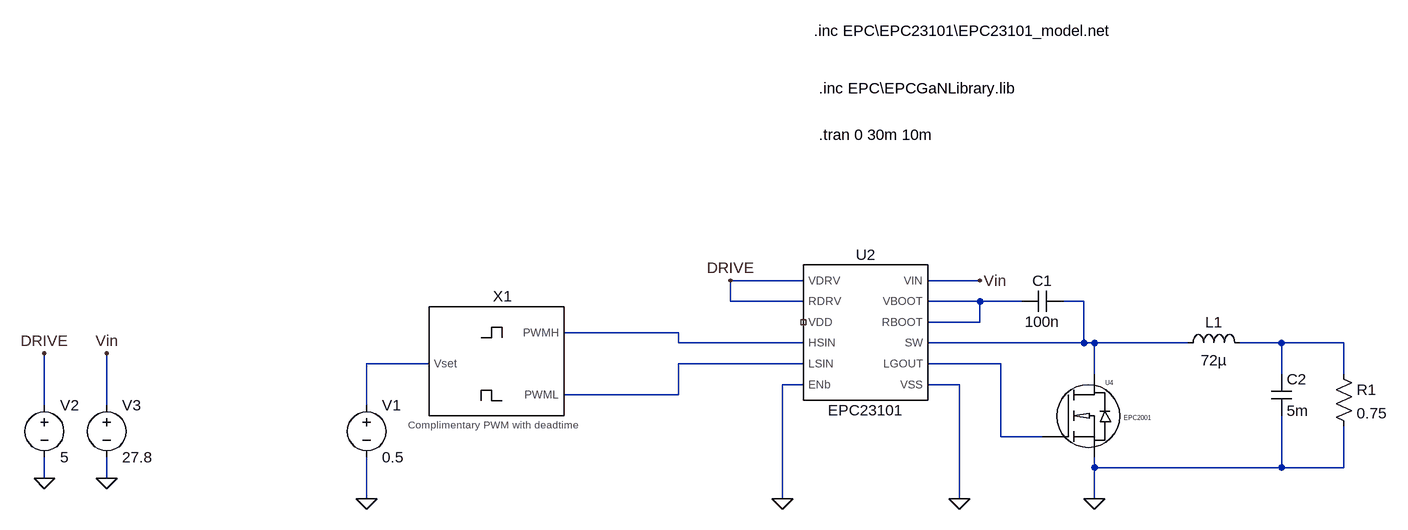
[diagram p0: schematic GaN.asc]
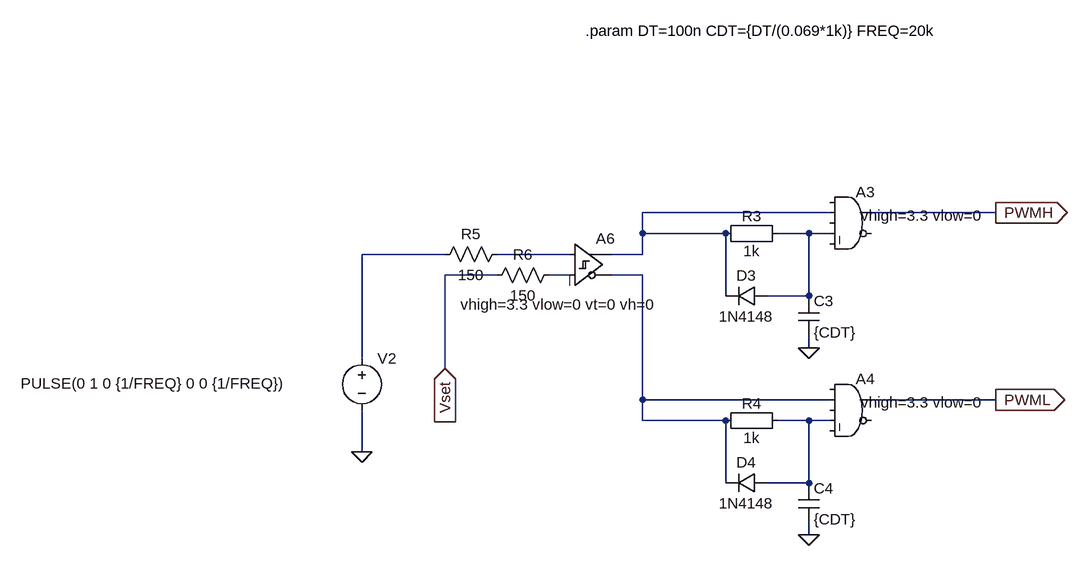
[diagram p1: sub-circuit pwmgen.asc]
GaN.asc, the LTspice schematic file:
Version 4.1
SHEET 1 1408 776
WIRE -224 -368 -336 -368
WIRE 48 -368 -32 -368
WIRE -336 -336 -336 -368
WIRE -224 -336 -336 -336
WIRE 48 -336 -32 -336
WIRE 112 -336 48 -336
WIRE 208 -336 176 -336
WIRE 48 -304 48 -336
WIRE 48 -304 -32 -304
WIRE -416 -288 -592 -288
WIRE -416 -272 -416 -288
WIRE -224 -272 -416 -272
WIRE 208 -272 208 -336
WIRE 208 -272 -32 -272
WIRE 224 -272 208 -272
WIRE 368 -272 224 -272
WIRE 512 -272 448 -272
WIRE 608 -272 512 -272
WIRE -800 -240 -896 -240
WIRE -224 -240 -416 -240
WIRE 80 -240 -32 -240
WIRE 224 -224 224 -272
WIRE 512 -224 512 -272
WIRE 608 -224 608 -272
WIRE -224 -208 -256 -208
WIRE 16 -208 -32 -208
WIRE -416 -192 -416 -240
WIRE -416 -192 -592 -192
WIRE -1392 -176 -1392 -256
WIRE -1296 -176 -1296 -256
WIRE -896 -176 -896 -240
WIRE 80 -128 80 -240
WIRE 144 -128 80 -128
WIRE 224 -80 224 -96
WIRE 512 -80 512 -160
WIRE 512 -80 224 -80
WIRE 608 -80 608 -144
WIRE 608 -80 512 -80
WIRE -1392 -64 -1392 -96
WIRE -1296 -64 -1296 -96
WIRE -896 -32 -896 -96
WIRE -256 -32 -256 -208
WIRE 16 -32 16 -208
WIRE 224 -32 224 -80
FLAG 48 -368 Vin
FLAG 16 -32 0
FLAG 224 -32 0
FLAG -256 -32 0
FLAG -336 -368 DRIVE
FLAG -896 -32 0
FLAG -1296 -64 0
FLAG -1392 -64 0
FLAG -1392 -256 DRIVE
FLAG -1296 -256 Vin
SYMBOL EPC\\EPC23101\\EPC23101_model -128 -288 R0
SYMATTR InstName U2
SYMBOL EPC\\EPCGaN 144 -128 R0
SYMATTR InstName U4
SYMATTR Value EPC2001
SYMBOL cap 176 -352 R90
WINDOW 0 0 32 VBottom 2
WINDOW 3 32 32 VTop 2
SYMATTR InstName C1
SYMATTR Value 100n
SYMBOL PWMGen\\PWMGen -688 -240 R0
SYMATTR InstName X1
SYMBOL voltage -896 -192 R0
WINDOW 123 0 0 Left 0
WINDOW 39 0 0 Left 0
SYMATTR InstName V1
SYMATTR Value 0.5
SYMBOL voltage -1392 -192 R0
WINDOW 123 0 0 Left 0
WINDOW 39 0 0 Left 0
SYMATTR InstName V2
SYMATTR Value 5
SYMBOL voltage -1296 -192 R0
WINDOW 123 0 0 Left 0
WINDOW 39 0 0 Left 0
SYMATTR InstName V3
SYMATTR Value 27.8
SYMBOL ind 352 -256 R270
WINDOW 0 32 56 VTop 2
WINDOW 3 5 56 VBottom 2
SYMATTR InstName L1
SYMATTR Value 72µ
SYMBOL cap 496 -224 R0
SYMATTR InstName C2
SYMATTR Value 5m
SYMBOL res 592 -240 R0
SYMATTR InstName R1
SYMATTR Value 0.75
TEXT -208 -752 Left 2 !.inc EPC\\EPC23101\\EPC23101_model.net
TEXT -200 -664 Left 2 !.inc EPC\\EPCGaNLibrary.lib
TEXT -200 -592 Left 2 !.tran 0 30m 10m

pwmgen.asc, the sub-circuit schematic file:
Version 4.1
SHEET 1 880 680
WIRE 384 0 96 0
WIRE 640 0 448 0
WIRE 96 32 96 0
WIRE 224 32 96 32
WIRE 352 32 304 32
WIRE 384 32 352 32
WIRE -208 64 -336 64
WIRE -16 64 -128 64
WIRE 96 64 96 32
WIRE 96 64 48 64
WIRE -128 96 -208 96
WIRE -16 96 -48 96
WIRE 96 96 48 96
WIRE 224 128 224 32
WIRE 352 128 352 32
WIRE 352 128 288 128
WIRE 352 208 352 192
WIRE -336 224 -336 64
WIRE -208 240 -208 96
WIRE 96 288 96 96
WIRE 384 288 96 288
WIRE 640 288 448 288
WIRE 96 320 96 288
WIRE 224 320 96 320
WIRE 352 320 304 320
WIRE 384 320 352 320
WIRE -336 368 -336 304
WIRE 224 416 224 320
WIRE 352 416 352 320
WIRE 352 416 288 416
WIRE 352 496 352 480
FLAG 352 208 0
FLAG -336 368 0
FLAG -208 240 Vset
IOPIN -208 240 In
FLAG 640 0 PWMH
IOPIN 640 0 Out
FLAG 352 496 0
FLAG 640 288 PWML
IOPIN 640 288 Out
DATAFLAG -336 368 ""
SYMBOL Digital\\and 416 -48 R0
WINDOW 39 16 52 Left 2
SYMATTR SpiceLine vhigh=3.3 vlow=0
SYMATTR InstName A3
SYMBOL Misc\\EuropeanResistor 320 16 R90
WINDOW 0 5 56 VBottom 2
WINDOW 3 27 56 VTop 2
SYMATTR InstName R3
SYMATTR Value 1k
SYMBOL diode 288 112 R90
WINDOW 0 0 32 VBottom 2
WINDOW 3 32 32 VTop 2
SYMATTR InstName D3
SYMATTR Value 1N4148
SYMBOL cap 336 128 R0
SYMATTR InstName C3
SYMATTR Value {CDT}
SYMBOL voltage -336 208 R0
WINDOW 3 -525 55 Left 2
WINDOW 123 0 0 Left 0
WINDOW 39 0 0 Left 0
SYMATTR Value PULSE(0 1 0 {1/FREQ} 0 0 {1/FREQ})
SYMATTR InstName V2
SYMBOL Digital\\and 416 240 R0
WINDOW 39 16 52 Left 2
SYMATTR SpiceLine vhigh=3.3 vlow=0
SYMATTR InstName A4
SYMBOL Misc\\EuropeanResistor 320 304 R90
WINDOW 0 5 56 VBottom 2
WINDOW 3 27 56 VTop 2
SYMATTR InstName R4
SYMATTR Value 1k
SYMBOL diode 288 400 R90
WINDOW 0 0 32 VBottom 2
WINDOW 3 32 32 VTop 2
SYMATTR InstName D4
SYMATTR Value 1N4148
SYMBOL cap 336 416 R0
SYMATTR InstName C4
SYMATTR Value {CDT}
SYMBOL Digital\\diffschmitt -16 16 R0
WINDOW 39 -168 125 Left 2
SYMATTR SpiceLine vhigh=3.3 vlow=0 vt=0 vh=0
SYMATTR InstName A6
SYMBOL res -112 48 R90
WINDOW 0 0 56 VBottom 2
WINDOW 3 32 56 VTop 2
SYMATTR InstName R5
SYMATTR Value 150
SYMBOL res -32 80 R90
WINDOW 0 0 56 VBottom 2
WINDOW 3 32 56 VTop 2
SYMATTR InstName R6
SYMATTR Value 150
TEXT 8 -280 Left 2 !.param DT=100n CDT={DT/(0.069*1k)} FREQ=20k

The netlist it stands for:
* GaN.asc
X§U2 0 N003 N006 DRIVE 0 N007 N001 DRIVE N002 N001 NC_01 Vin EPC23101  ; pins ENb HSIN LSIN VDRV VSS LGOUT RBOOT RDRV SW VBOOT VDD VIN
X§U4 N007 N002 0 EPC2001  ; pins gatein drainin N_0
C1 N002 N001 100n
X§X1 N005 N003 N006 pwmgen
V1 N005 0 0.5
V2 DRIVE 0 5
V3 Vin 0 27.8
L1 N002 N004 72µ
C2 N004 0 5m
R1 N004 0 0.75

* block symbol definitions
.subckt pwmgen Vset PWMH PWML
A3 0 N001 0 N002 0 0 PWMH 0 AND vhigh=3.3 vlow=0
R3 N002 N001 1k
D3 N002 N001 1N4148
C3 N002 0 {CDT}
V2 N003 0 PULSE(0 1 0 {1/FREQ} 0 0 {1/FREQ})
A4 0 N006 0 N007 0 0 PWML 0 AND vhigh=3.3 vlow=0
R4 N007 N006 1k
D4 N007 N006 1N4148
C4 N007 0 {CDT}
A6 N004 N005 0 0 0 N006 N001 0 SCHMITT vhigh=3.3 vlow=0 vt=0 vh=0
R5 N004 N003 150
R6 N005 Vset 150
.param DT=100n CDT={DT/(0.069*1k)} FREQ=20k
.ends pwmgen

.model D D
.lib standard.dio
.inc EPC\EPC23101\EPC23101_model.net
.inc EPC\EPCGaNLibrary.lib
.tran 0 30m 10m
.lib EPC\EPCGanLibrary.lib
.backanno
.end